# Altium schematic sheet QCopterRC_KEY_Sch.SchDoc
size A4
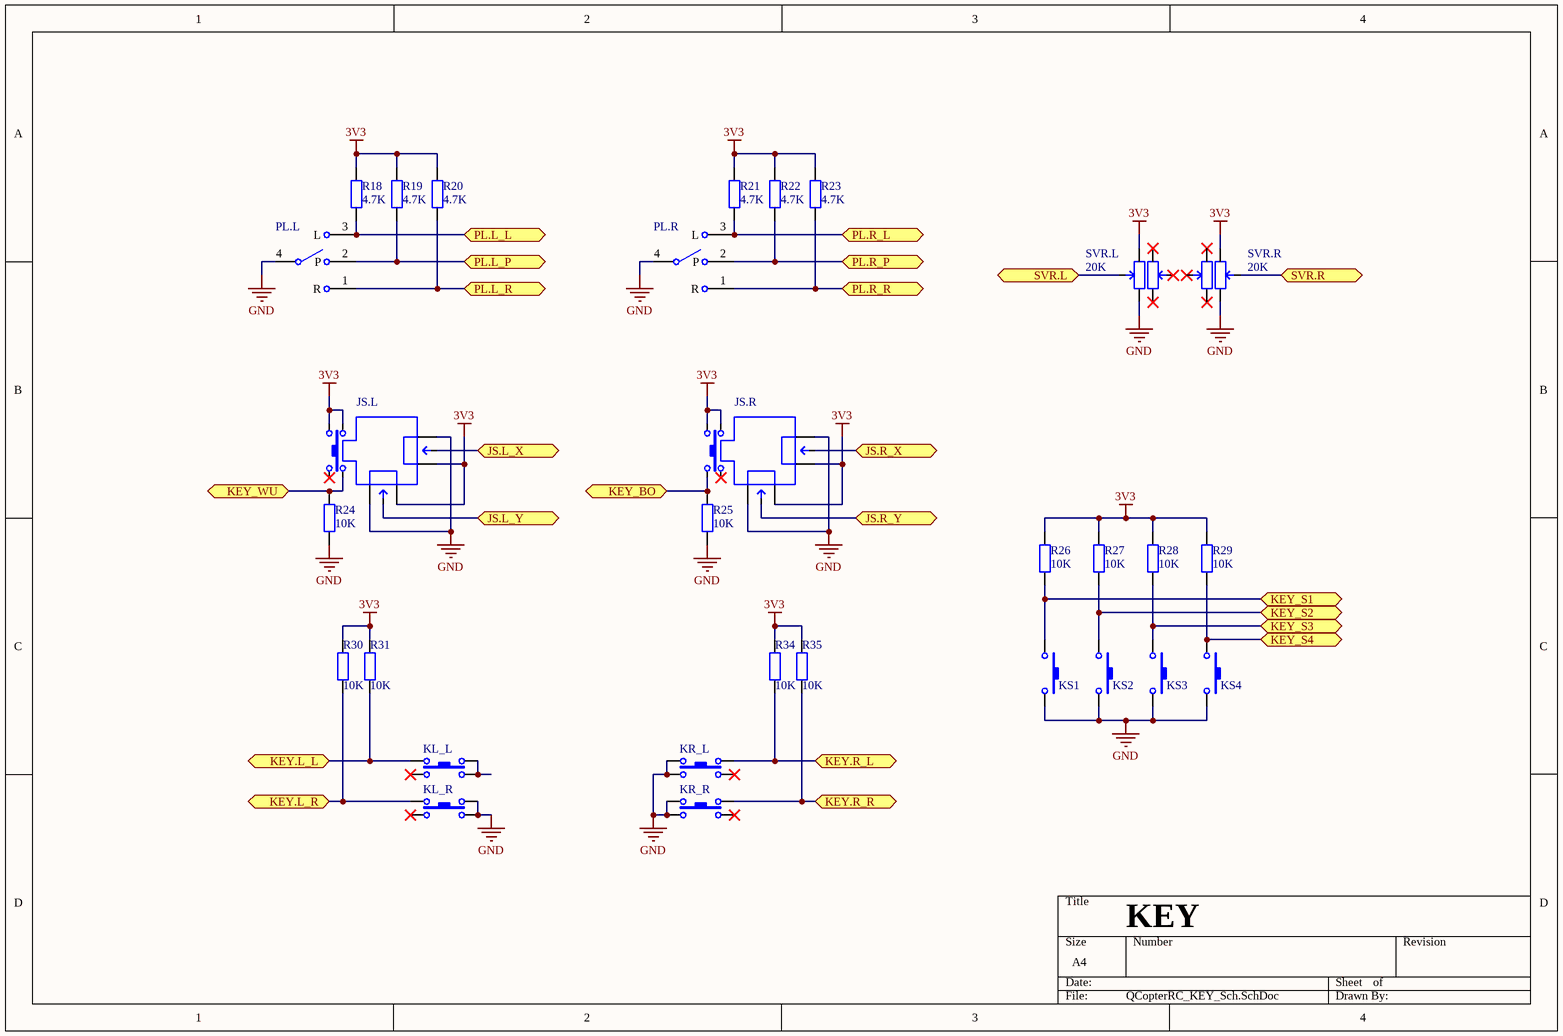
[diagram p0: QCopterRC_KEY_Sch.SchDoc]

## Parts
JS.L  JoyStick  [JoyStick]  (value not drawn)
JS.R  JoyStick  [JoyStick]  (value not drawn)
KL_L  BT_TACT_12X12_D180  [BT_TACT_12X12_D180]  (value not drawn)
KL_R  BT_TACT_12X12_D180  [BT_TACT_12X12_D180]  (value not drawn)
KR_L  BT_TACT_12X12_D180  [BT_TACT_12X12_D180]  (value not drawn)
KR_R  BT_TACT_12X12_D180  [BT_TACT_12X12_D180]  (value not drawn)
KS1  BT_TACT_3x6_180  [BT_TACT_3x6_180]  (value not drawn)
KS2  BT_TACT_3x6_180  [BT_TACT_3x6_180]  (value not drawn)
KS3  BT_TACT_3x6_180  [BT_TACT_3x6_180]  (value not drawn)
KS4  BT_TACT_3x6_180  [BT_TACT_3x6_180]  (value not drawn)
PL.L  BT_PushLever_11*12_90  [BT_PushLever_11*12_90]  (value not drawn)
PL.R  BT_PushLever_11*12_90  [BT_PushLever_11*12_90]  (value not drawn)
R18  value 4.7K  [RES_0603]  (hidden comment: Res_0603)
R19  value 4.7K  [RES_0603]  (hidden comment: Res_0603)
R20  value 4.7K  [RES_0603]  (hidden comment: Res_0603)
R21  value 4.7K  [RES_0603]  (hidden comment: Res_0603)
R22  value 4.7K  [RES_0603]  (hidden comment: Res_0603)
R23  value 4.7K  [RES_0603]  (hidden comment: Res_0603)
R24  value 10K  [RES_0603]  (hidden comment: Res_0603)
R25  value 10K  [RES_0603]  (hidden comment: Res_0603)
R26  value 10K  [RES_0603]  (hidden comment: Res_0603)
R27  value 10K  [RES_0603]  (hidden comment: Res_0603)
R28  value 10K  [RES_0603]  (hidden comment: Res_0603)
R29  value 10K  [RES_0603]  (hidden comment: Res_0603)
R30  value 10K  [RES_0603]  (hidden comment: Res_0603)
R31  value 10K  [RES_0603]  (hidden comment: Res_0603)
R34  value 10K  [RES_0603]  (hidden comment: Res_0603)
R35  value 10K  [RES_0603]  (hidden comment: Res_0603)
SVR.L  value 20K  [RES_45MM_DIP]  (hidden comment: RES_45MM_DIP)
SVR.R  value 20K  [RES_45MM_DIP]  (hidden comment: RES_45MM_DIP)

## Ports
JS.L_X, JS.L_Y, JS.R_X, JS.R_Y, KEY.L_L, KEY.L_R, KEY.R_L, KEY.R_R, KEY_BO, KEY_S1, KEY_S2, KEY_S3, KEY_S4, KEY_WU, PL.L_L, PL.L_P, PL.L_R, PL.R_L, PL.R_P, PL.R_R, SVR.L, SVR.R

## Nets
3V3: JS.L.3 JS.L.4 JS.L.7 JS.L.9 JS.R.3 JS.R.4 JS.R.7 JS.R.9 R18.1 R19.1 R20.1 R21.1 R22.1 R23.1 R26.1 R27.1 R28.1 R29.1 R30.1 R31.1 R34.1 R35.1 SVR.L.1(U) SVR.R.3(U)
GND: JS.L.1 JS.L.6 JS.R.1 JS.R.6 KL_R.2 KL_R.4 KR_L.1 KR_L.3 KR_R.1 KR_R.3 KS1.2 KS2.2 KS3.2 KS4.2 PL.L.4 PL.R.4 R24.2 R25.2 SVR.L.5(D) SVR.R.6(D)
JS.L_X: JS.L.5 ; port JS.L_X
JS.L_Y: JS.L.2 ; port JS.L_Y
JS.R_X: JS.R.5 ; port JS.R_X
JS.R_Y: JS.R.2 ; port JS.R_Y
KEY.L_L: KL_L.1 R31.2 ; port KEY.L_L
KEY.L_R: KL_R.1 R30.2 ; port KEY.L_R
KEY.R_L: KR_L.2 R34.2 ; port KEY.R_L
KEY.R_R: KR_R.2 R35.2 ; port KEY.R_R
KEY_BO: JS.R.8 R25.1 ; port KEY_BO
KEY_S1: KS1.1 R26.2 ; port KEY_S1
KEY_S2: KS2.1 R27.2 ; port KEY_S2
KEY_S3: KS3.1 R28.2 ; port KEY_S3
KEY_S4: KS4.1 R29.2 ; port KEY_S4
KEY_WU: JS.L.10 R24.1 ; port KEY_WU
PL.L_L: PL.L.3(L) R18.2 ; port PL.L_L
PL.L_P: PL.L.2(P) R19.2 ; port PL.L_P
PL.L_R: PL.L.1(R) R20.2 ; port PL.L_R
PL.R_L: PL.R.3(L) R21.2 ; port PL.R_L
PL.R_P: PL.R.2(P) R22.2 ; port PL.R_P
PL.R_R: PL.R.1(R) R23.2 ; port PL.R_R
SVR.L: SVR.L.2(W) ; port SVR.L
SVR.R: SVR.R.4(W) ; port SVR.R
NetKL_L_2: KL_L.2 KL_L.4

Not connected (* = marked no-connect by the designer): JS.L 8*; JS.R 10*; KL_L 3*; KL_R 3*; KR_L 4*; KR_R 4*; SVR.L 3(U)* 4(W)* 6(D)*; SVR.R 1(U)* 2(W)* 5(D)*

## Notes on the sheet
- KEY

## Library data of the parts
KL_L KL_R KR_L KR_R = BT_TACT_12X12_D180: Switch
KS1-KS4 = BT_TACT_3x6_180: Switch
PL.L PL.R = BT_PushLever_11*12_90: Switch
R18-R31 R34 R35 = Res_0603: Resistor
SVR.L SVR.R = RES_45MM_DIP: Resistor